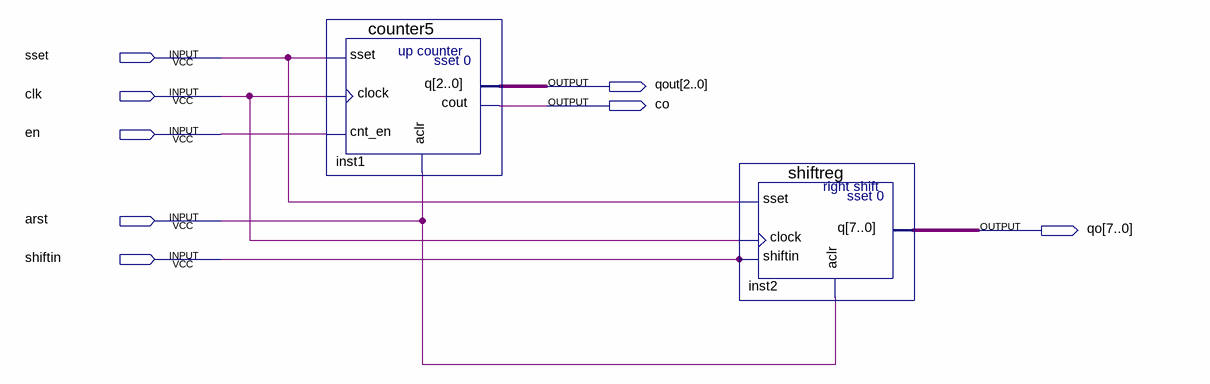
[diagram p0: schematic sheet]
// Quartus schematic bQ.bdf as structural Verilog: 2 symbols, 8 pins
module bQ (
  input  sset,
  input  clk,
  input  en,
  input  arst,
  input  shiftin,
  output [2:0] qout,
  output co,
  output [7:0] qo
);

  counter5 inst1 (.sset(sset), .clock(clk), .cnt_en(en), .aclr(arst), .cout(co), .q(qout));
  shiftreg inst2 (.sset(sset), .clock(clk), .shiftin(shiftin), .aclr(arst), .q(qo));
endmodule
